# Altium project TADQ Sonic Spoon.PrjPcb
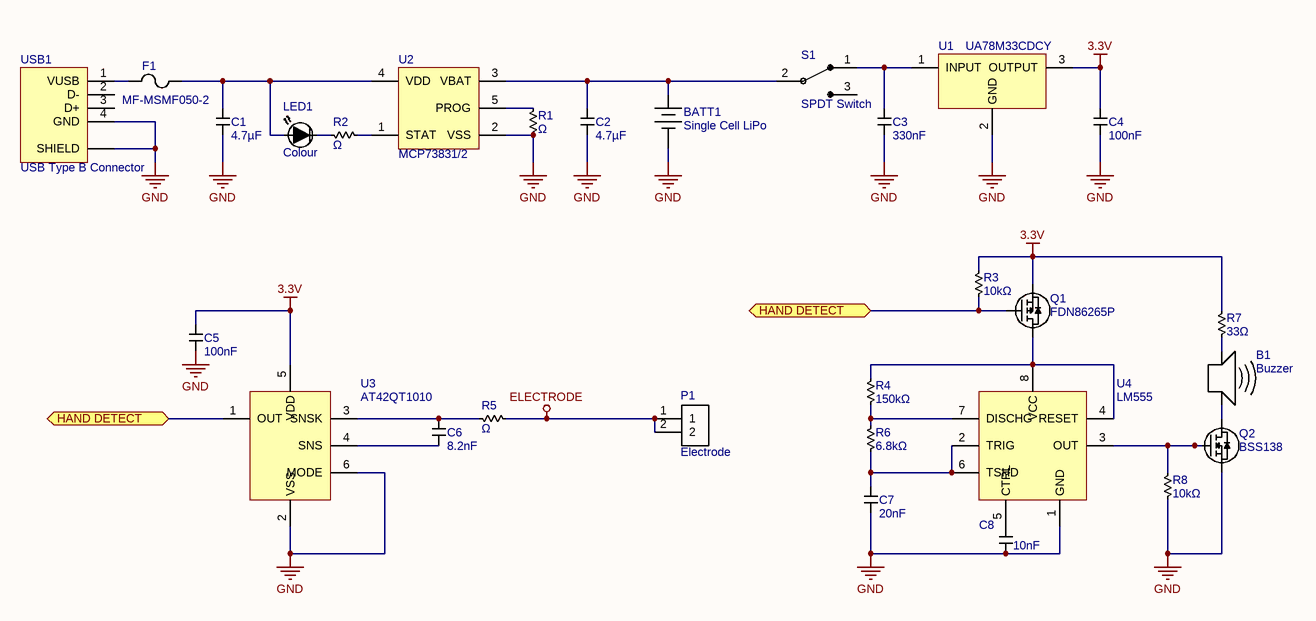
[diagram p0: Power Supply.SchDoc]
1 sheet, 29 parts. Net scope: flat (ports and power ports of the same name join across sheets).

## Sheet Power Supply.SchDoc: TADQ Auditory Feedback Utensil Driver
size A3; Author: William Rigby; CompanyName: Rigby Electronics; Engineer: William Rigby; Organization: Rigby Electronics; Revision: A; SheetNumber: 1; SheetTotal: 1

### Parts
B1  Buzzer  [RS-PRO 535-8449]
BATT1  Single Cell LiPo  [S2B-XH-A(LF)(SN)]
C1  4.7µF  [0805]
C2  4.7µF  [0805]
C3  330nF  [0603]
C4  100nF  [0603]
C5  100nF  [0603]
C6  8.2nF  [0603]
C7  20nF  [0603]
C8  10nF  [0603]
F1  MF-MSMF050-2  [MF-MSMF050-2]
LED1  Colour  [0603LED]
P1  Electrode  [S2B-XH-A(LF)(SN)]
Q1  FDN86265P  [FDN86265P]
Q2  BSS138  [BSS138]
R1  Ω  [0603]
R2  Ω  [0603]
R3  10kΩ  [0603]
R4  150kΩ  [0603]
R5  Ω  [0603]
R6  6.8kΩ  [0603]
R7  33Ω  [0603]
R8  10kΩ  [0603]
S1  SPDT Switch  [MFP120-R]
U1  UA78M33CDCY  [UA78M33CDCY]
U2  MCP73831/2  [MCP73831]
U3  AT42QT1010  [AT42QT1010]
U4  LM555  [LM555]
USB1  USB Type B Connector  [Amphenol FCI 10103594-0001LF]

### Ports
HAND DETECT

### Nets
3.3V: C4.1 C5.1 Q1.S R3.2 R7.2 U1.3(OUTPUT) U3.5(VDD)
ELECTRODE: P1.1 P1.2 R5.2
GND: BATT1.2 C1.2 C2.2 C3.2 C4.2 C5.2 C7.2 C8.2 Q2.S R1.2 R8.1 U1.2(GND) U2.2(VSS) U3.2(VSS) U3.6(MODE) U4.1(GND) USB1.4(GND) USB1.SHIELD
NetB1_1: B1.1 R7.1
NetB1_2: B1.2 Q2.D
NetBATT1_1: BATT1.1 C2.1 S1.2 U2.3(VBAT)
NetC1_1: C1.1 F1.2 LED1.1 U2.4(VDD)
NetC3_1: C3.1 S1.1 U1.1(INPUT)
NetC6_1: C6.1 R5.1 U3.3(SNSK)
NetC6_2: C6.2 U3.4(SNS)
NetC7_1: C7.1 R6.1 U4.2(TRIG) U4.6(TSHD)
NetC8_1: C8.1 U4.5(CTRL)
NetF1_1: F1.1 USB1.1(VUSB)
NetLED1_2: LED1.2 R2.1
NetQ1_D: Q1.D R4.2 U4.4(RESET) U4.8(VCC)
NetQ1_G: Q1.G R3.1 U3.1(OUT) ; port HAND DETECT
NetQ2_G: Q2.G R8.2 U4.3(OUT)
NetR1_1: R1.1 U2.5(PROG)
NetR2_2: R2.2 U2.1(STAT)
NetR4_1: R4.1 R6.2 U4.7(DISCHG)

Not connected (* = marked no-connect by the designer): S1 3; USB1 2(D-) 3(D+)

### Notes on the sheet
- Title:
- Size:
- Date:
- A3
- Number:
- Time:
- Revision:
- Sheet
- of
- Drawn by:
- File:

### Library data of the parts
B1 = Buzzer: Piezo Buzzer External Drive
BATT1 = Battery
C1-C8 = Capacitor
F1 = MF-MSMF050-2: Resettable Fuse 0.5A 15V
LED1 = LED: Light Emitting Diode
P1 = Header 2: 2 Pin Header
Q1 = FDN86265P: P-Channel Logic Level MOSFET
Q2 = BSS138: N-Channel Logic Level MOSFET
R1-R8 = Resistor: Standard Resistor
U1 = UA78M33CDCY: Linear Voltage Regulator 3.3V 500mA 25V Input
U2 = MCP73831/2: Li-Ion Charge Management Controller
U3 = AT42QT1010: Digital Burst Mode Charge Transfer Sensor
U4 = LM555: 555 Timer IC
USB1 = USB Type B Female Connector: USB Type B Female Connector Right Angle Through Hole